# EAGLE design masternode (EAGLE 7.6.0)
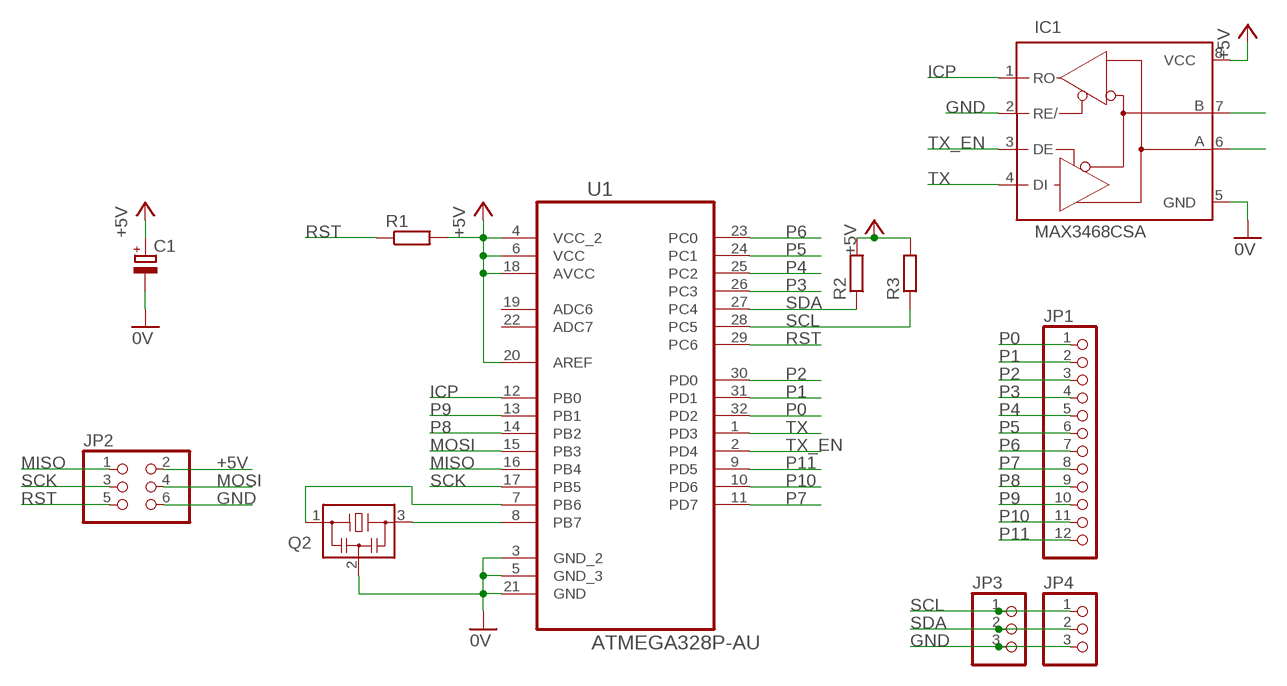
[diagram p0: schematic, sheet 1]

## Parts
C1  CPOL-EU153CLV-0405  [153CLV-0405]
IC1  MAX3468CSA  [SO08]
JP1  PINHD-1X12  [1X12]
JP2  PINHD-2X3  [2X03]
JP3  PINHD-1X3  [1X03]
JP4  PINHD-1X3  [1X03]
Q2  CSTCR6M00G53Z  [CSTCR6M]
R1  R-EU_R0402  [R0402]
R2  R-EU_R0402  [R0402]
R3  R-EU_R0402  [R0402]
U1  ATMEGA328P-AU  [QFP80P900X900X120-32N]

## Nets
+5V: C1.+ IC1.8(VCC) JP2.2 R1.2 R2.2 R3.2 U1.4(VCC_2) U1.6(VCC) U1.18(AVCC) U1.20(AREF)
A: IC1.6(A)
B: IC1.7(B)
GND: C1.- IC1.2(RE/) IC1.5(GND) JP2.6 JP3.3 JP4.3 Q2.2 U1.3(GND_2) U1.5(GND_3) U1.21(GND) ; supply symbol labelled 0V
ICP: IC1.1(RO) U1.12(PB0)
MISO: JP2.1 U1.16(PB4)
MOSI: JP2.4 U1.15(PB3)
N$1: Q2.3 U1.8(PB7)
N$2: Q2.1 U1.7(PB6)
P0: JP1.1 U1.32(PD2)
P1: JP1.2 U1.31(PD1)
P2: JP1.3 U1.30(PD0)
P3: JP1.4 U1.26(PC3)
P4: JP1.5 U1.25(PC2)
P5: JP1.6 U1.24(PC1)
P6: JP1.7 U1.23(PC0)
P7: JP1.8 U1.11(PD7)
P8: JP1.9 U1.14(PB2)
P9: JP1.10 U1.13(PB1)
P10: JP1.11 U1.10(PD6)
P11: JP1.12 U1.9(PD5)
RST: JP2.5 R1.1 U1.29(PC6)
SCK: JP2.3 U1.17(PB5)
SCL: JP3.1 JP4.1 R3.1 U1.28(PC5)
SDA: JP3.2 JP4.2 R2.1 U1.27(PC4)
TX: IC1.4(DI) U1.1(PD3)
TX_EN: IC1.3(DE) U1.2(PD4)
Unconnected: U1.19(ADC6) U1.22(ADC7)

## Library data of the parts
C1 = resistor:CPOL-EU: POLARIZED CAPACITOR, European symbol
IC1 = maxim:MAX34*: +5V, Fail-Safe, 40Mbps, Profibus RS-485/RS-422 Transceivers Source: MAX3465-MAX3469.pdf; MPN: MAX3468CSA+; OC_FARNELL: unknown; OC_NEWARK: 76K6721
JP1 = pinhead:PINHD-1X12: PIN HEADER
JP2 = pinhead:PINHD-2X3: PIN HEADER
JP3 JP4 = pinhead:PINHD-1X3: PIN HEADER
Q2 = murata-filter:CSTCR: Resonator Source: murata.co.jp; MPN: CSTCR6M00G53-R0; OC_FARNELL: 1170434; OC_NEWARK: 25M8759
R1-R3 = resistor:R-EU_: RESISTOR, European symbol
U1 = Atmel_By_element14_Batch_1-00:ATMEGA328P-AU: 8-bit Microcontroller with In-System Programmable Flash; MPN: ATMEGA328P-AU; OC_FARNELL: 1715486; OC_NEWARK: 14R4631; PACKAGE: TQFP-32; SUPPLIER: Atmel

## Board
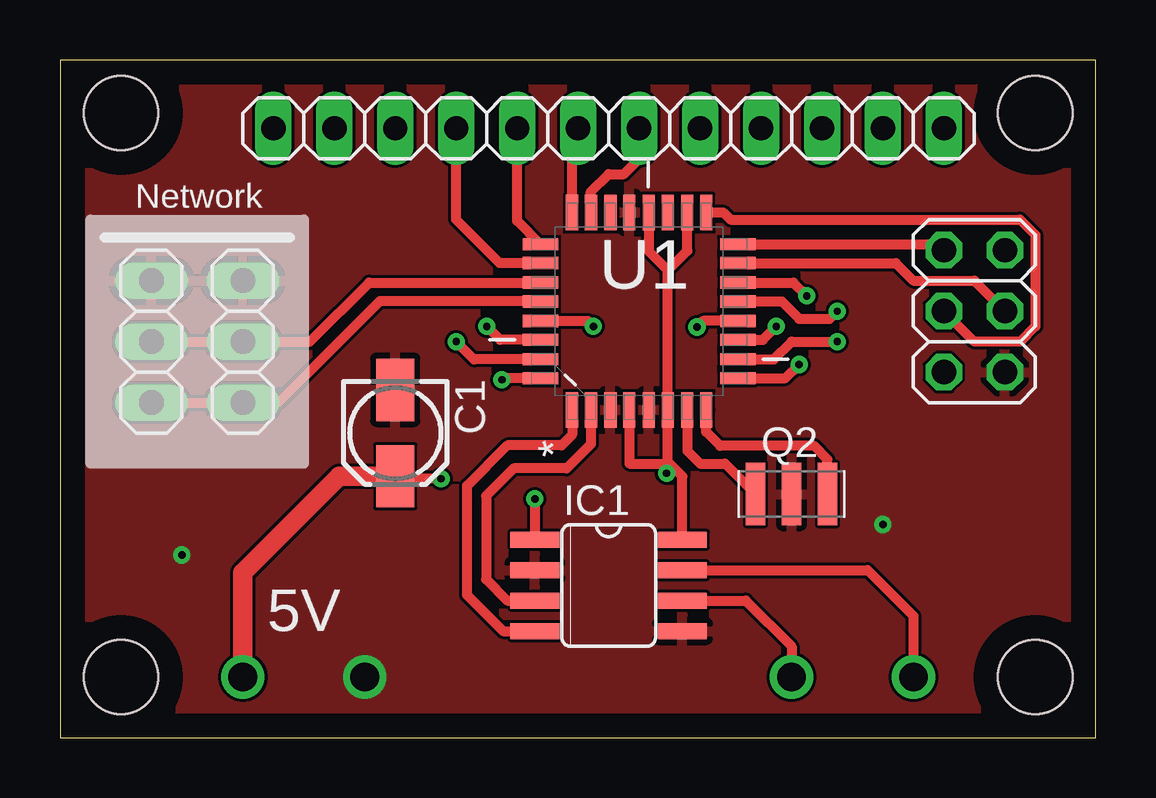
[diagram p1: board, top side]
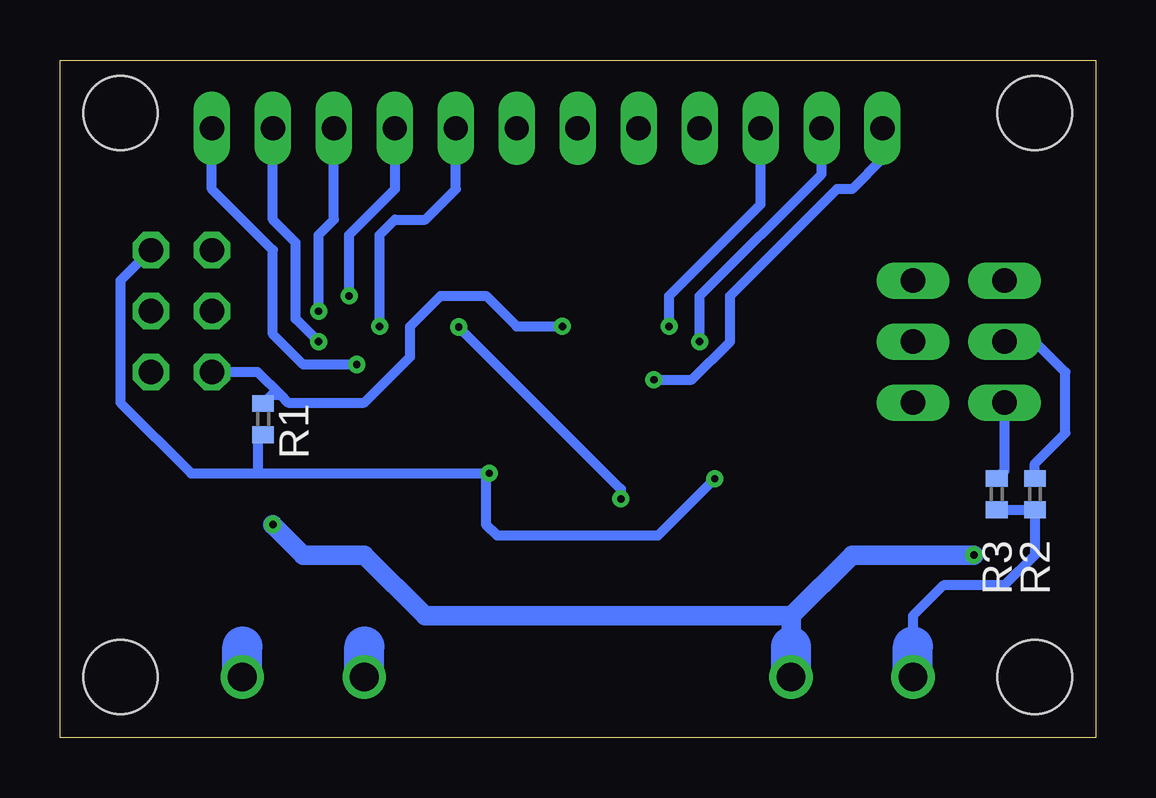
[diagram p2: board, bottom side, seen from below]

Size 43.16 x 28.25 mm. Coordinates in mm from the lower left corner, seen from the top.
Outline: 0,0 43.16,0 43.16,28.25 0,28.25 0,0
Copper layers (1*16): Top 0.035mm / dielectric 1.5mm / Bottom 0.035mm
Design rules "default *": minimum track width 10mil, minimum drill 0.3mm, track to track 5mil, track to pad 5mil, pad to pad 5mil, via to via 5mil, smd to smd 5mil, copper to edge 40mil, drill to drill 8mil, minimum pad ring 10mil, minimum via ring 8mil, stop-mask expansion 4mil, vias tented up to drill 15mil, thermal gap 10mil
Holes 3.1 mm at 2.54,2.54 40.64,2.54 40.64,26.04 2.54,26.04

### Footprints (pad centres in the part's own frame; a part is rotated, then mirrored left to right if it is on the bottom)
153CLV-0405 = smd 2.6 x 1.6: + 1.8,0; - -1.8,0
SO08 = smd 0.66 x 2.032: 1 -1.905,-3.073; 2 -0.635,-3.073; 3 0.635,-3.073; 4 1.905,-3.073; 5 1.905,3.073; 6 0.635,3.073; 7 -0.635,3.073; 8 -1.905,3.073
1X12 = drill 1.016 long: 1 -13.97,0; 2 -11.43,0; 3 -8.89,0; 4 -6.35,0; 5 -3.81,0; 6 -1.27,0; 7 1.27,0; 8 3.81,0; 9 6.35,0; 10 8.89,0; 11 11.43,0; 12 13.97,0
2X03 = drill 1.016 octagon: 1 -2.54,-1.27; 2 -2.54,1.27; 3 0,-1.27; 4 0,1.27; 5 2.54,-1.27; 6 2.54,1.27
1X03 = drill 1.016 long: 1 -2.54,0; 2 0,0; 3 2.54,0
CSTCR6M = smd 0.8 x 2.6: 1 -1.5,0; 2 0,0; 3 1.5,0
R0402 = smd 0.7 x 0.9: 1 -0.65,0; 2 0.65,0
QFP80P900X900X120-32N = smd 1.473 x 0.508: 1 -4.115,2.794; 2 -4.115,2.007; 3 -4.115,1.194; 4 -4.115,0.406; 5 -4.115,-0.406; 6 -4.115,-1.194; 7 -4.115,-2.007; 8 -4.115,-2.794; 17 4.115,-2.794; 18 4.115,-2.007; 19 4.115,-1.194; 20 4.115,-0.406; 21 4.115,0.406; 22 4.115,1.194; 23 4.115,2.007; 24 4.115,2.794 | smd 0.508 x 1.473: 9 -2.794,-4.115; 10 -2.007,-4.115; 11 -1.194,-4.115; 12 -0.406,-4.115; 13 0.406,-4.115; 14 1.194,-4.115; 15 2.007,-4.115; 16 2.794,-4.115; 25 2.794,4.115; 26 2.007,4.115; 27 1.194,4.115; 28 0.406,4.115; 29 -0.406,4.115; 30 -1.194,4.115; 31 -2.007,4.115; 32 -2.794,4.115

### Placement (x,y rotation side)
C1  13.97,12.7 270 top
IC1  22.86,6.35 270 top
JP1  22.86,25.4 0 top
JP2  38.1,17.78 270 top
JP3  3.81,16.51 90 top
JP4  7.62,16.51 90 top
Q2  30.48,10.16 0 top
R1  34.7,13.28 270 bottom
R2  2.54,10.16 270 bottom
R3  4.13,10.16 270 bottom
U1  24.13,17.78 90 top

### Tracks (layer width: path | path; a pad name or v marks a point on that pad's centre or on a via)
+5V  (via drill 0.3, 1.2)
  Top 0.406: IC1.8 25.93,10.9 25.4,11.43 | 25.4,11.43 25.32,11.51 U1.6 25.32,19.48 | 25.32,19.48 26.14,20.3 U1.18 | U1.20 24.54,20.27 25.32,19.48 | 25.4,11.43 23.72,11.43 U1.4 | 25.4,11.43 25.4,11.15 v25.27,11.02 | C1.+ 14.07,10.79 v15.88,10.79
  Top 0.813: C1.+ 11.64,10.9 7.62,6.88 v7.62,2.54
  Bottom 0.406: JP2.2 40.64,19.05 40.64,13.97 37.69,11.02 34.92,11.02 | 34.92,11.02 v25.27,11.02 25.4,10.9 25.4,8.89 24.94,8.43 18.24,8.43 v15.88,10.79 | R1.2 34.92,12.41 34.92,11.02 | R3.2 R2.2 2.54,7.62 3.81,6.35 6.35,6.35 7.62,5.08 7.62,3.81
  Bottom 1.676: v7.62,2.54 7.62,3.81
A  (via drill 1.2)
  Top 0.406: IC1.6 28.57,5.71 30.48,3.81 v30.48,2.54
  Bottom 1.676: v30.48,2.54 30.48,3.81
B  (via drill 1.2)
  Top 0.406: IC1.7 33.66,6.99 35.56,5.08 v35.56,2.54
  Bottom 1.676: v35.56,2.54 35.56,3.81
GND  (via drill 0.3, 1.2)
  Bottom 0.813: 12.7,5.08 10.16,7.62 v5.08,7.62 | 12.7,5.08 27.94,5.08 30.48,7.62 33.02,7.62 v34.29,8.89 | 12.7,3.81 12.7,5.08
  Bottom 1.676: v12.7,2.54 12.7,3.81
  pour Top: 43.18,28.57 0,28.57 0,0 43.18,0
ICP  (via drill 0.3)
  Top 0.406: U1.12 26.8,17.37 v26.54,17.12 | v19.79,9.96 IC1.1
  Bottom 0.406: v26.54,17.12 19.79,10.36 v19.79,9.96
MISO
  Top 0.406: U1.16 36.58,20.57 JP2.1
MOSI
  Top 0.406: U1.15 34.82,19.79 35.56,19.05 38.1,19.05 JP2.4
N$1
  Top 0.406: 26.98,13.66 U1.8 26.92,12.75 27.51,12.17 31.42,12.17 31.98,11.61 Q2.3
N$2
  Top 0.406: U1.7 26.14,11.96 26.67,11.43 27.71,11.43 Q2.1
P0  (via drill 0.3)
  Top 0.406: U1.32 18.48,14.99 v18.41,14.92
  Bottom 0.406: v18.41,14.92 16.83,14.92 15.24,16.51 15.24,18.41 10.79,22.86 10.16,22.86 8.89,24.13 JP1.1
P1  (via drill 0.3)
  Top 0.406: U1.31 17.25,15.77 v16.51,16.51
  Bottom 0.406: v16.51,16.51 16.51,18.41 11.43,23.5 JP1.2
P2  (via drill 0.3)
  Top 0.406: U1.30 18.34,16.59 v17.78,17.14
  Bottom 0.406: v17.78,17.14 17.78,18.41 13.97,22.23 JP1.3
P3
  Top 0.406: U1.26 18.31,19.79 16.51,21.59 JP1.4
P4
  Top 0.406: U1.25 19.05,21.54 JP1.5
P5
  Top 0.406: U1.24 21.34,25.15 JP1.6
P6
  Top 0.406: U1.23 22.12,22.76 22.86,23.5 23.5,23.5 24.13,24.13 JP1.7
P7  (via drill 0.3)
  Top 0.406: U1.11 29.29,16.59 v29.84,17.14
  Bottom 0.406: v29.84,17.14 29.84,20.95 29.21,21.59 27.94,21.59 26.67,22.86 JP1.8
P8  (via drill 0.3)
  Top 0.406: U1.14 30.56,18.97 v31.11,18.41
  Bottom 0.406: v31.11,18.41 31.11,20.95 29.21,22.86 JP1.9
P9  (via drill 0.3)
  Top 0.406: U1.13 30.07,18.19 30.8,17.46 32.07,17.46 v32.38,17.78
  Bottom 0.406: v32.38,17.78 32.38,20.95 31.75,21.59 JP1.10
P10  (via drill 0.3)
  Top 0.406: U1.10 29.74,15.77 30.48,16.51 v32.38,16.51
  Bottom 0.406: v32.38,16.51 33.34,17.46 33.34,20.64 34.29,21.59 JP1.11
P11  (via drill 0.3)
  Top 0.406: U1.9 30.23,14.99 v30.8,15.56
  Bottom 0.406: v30.8,15.56 33.02,15.56 34.29,16.83 34.29,20.32 36.83,22.86 JP1.12
RST  (via drill 0.3)
  Top 0.406: U1.29 22,17.37 v22.23,17.14
  Bottom 0.406: JP2.5 34.92,15.24 33.97,14.29 | 33.97,14.29 33.66,13.97 30.48,13.97 28.57,15.88 28.57,17.14 27.3,18.41 25.4,18.41 24.13,17.14 v22.23,17.14 | R1.1 34.34,14.29 33.97,14.29
SCK
  Top 0.406: U1.17 27.64,21.89 27.94,21.59 40.01,21.59 40.64,20.95 40.64,17.14 40.01,16.51 38.1,16.51 JP2.3
SCL
  Top 0.406: JP3.1 JP4.1 9.09,13.97 13.34,18.21 19.99,18.21 U1.28
  Bottom 0.406: JP3.1 3.81,11.13 R3.1
SDA
  Top 0.406: JP3.2 JP4.2 10.41,16.51 12.88,18.97 U1.27
  Bottom 0.406: R2.1 2.54,11.43 1.27,12.7 1.27,15.24 2.54,16.51 JP3.2
TX
  Top 0.406: U1.1 21.34,12.62 20.9,12.19 18.64,12.19 16.97,10.52 16.97,5.94 18.47,4.45 IC1.4
TX_EN
  Top 0.406: U1.2 22.12,12.24 21.11,11.23 18.9,11.23 17.75,10.08 17.75,6.6 18.64,5.71 IC1.3

### Text on the board
tNames: Network | 5V
tValues: + | - | A | B